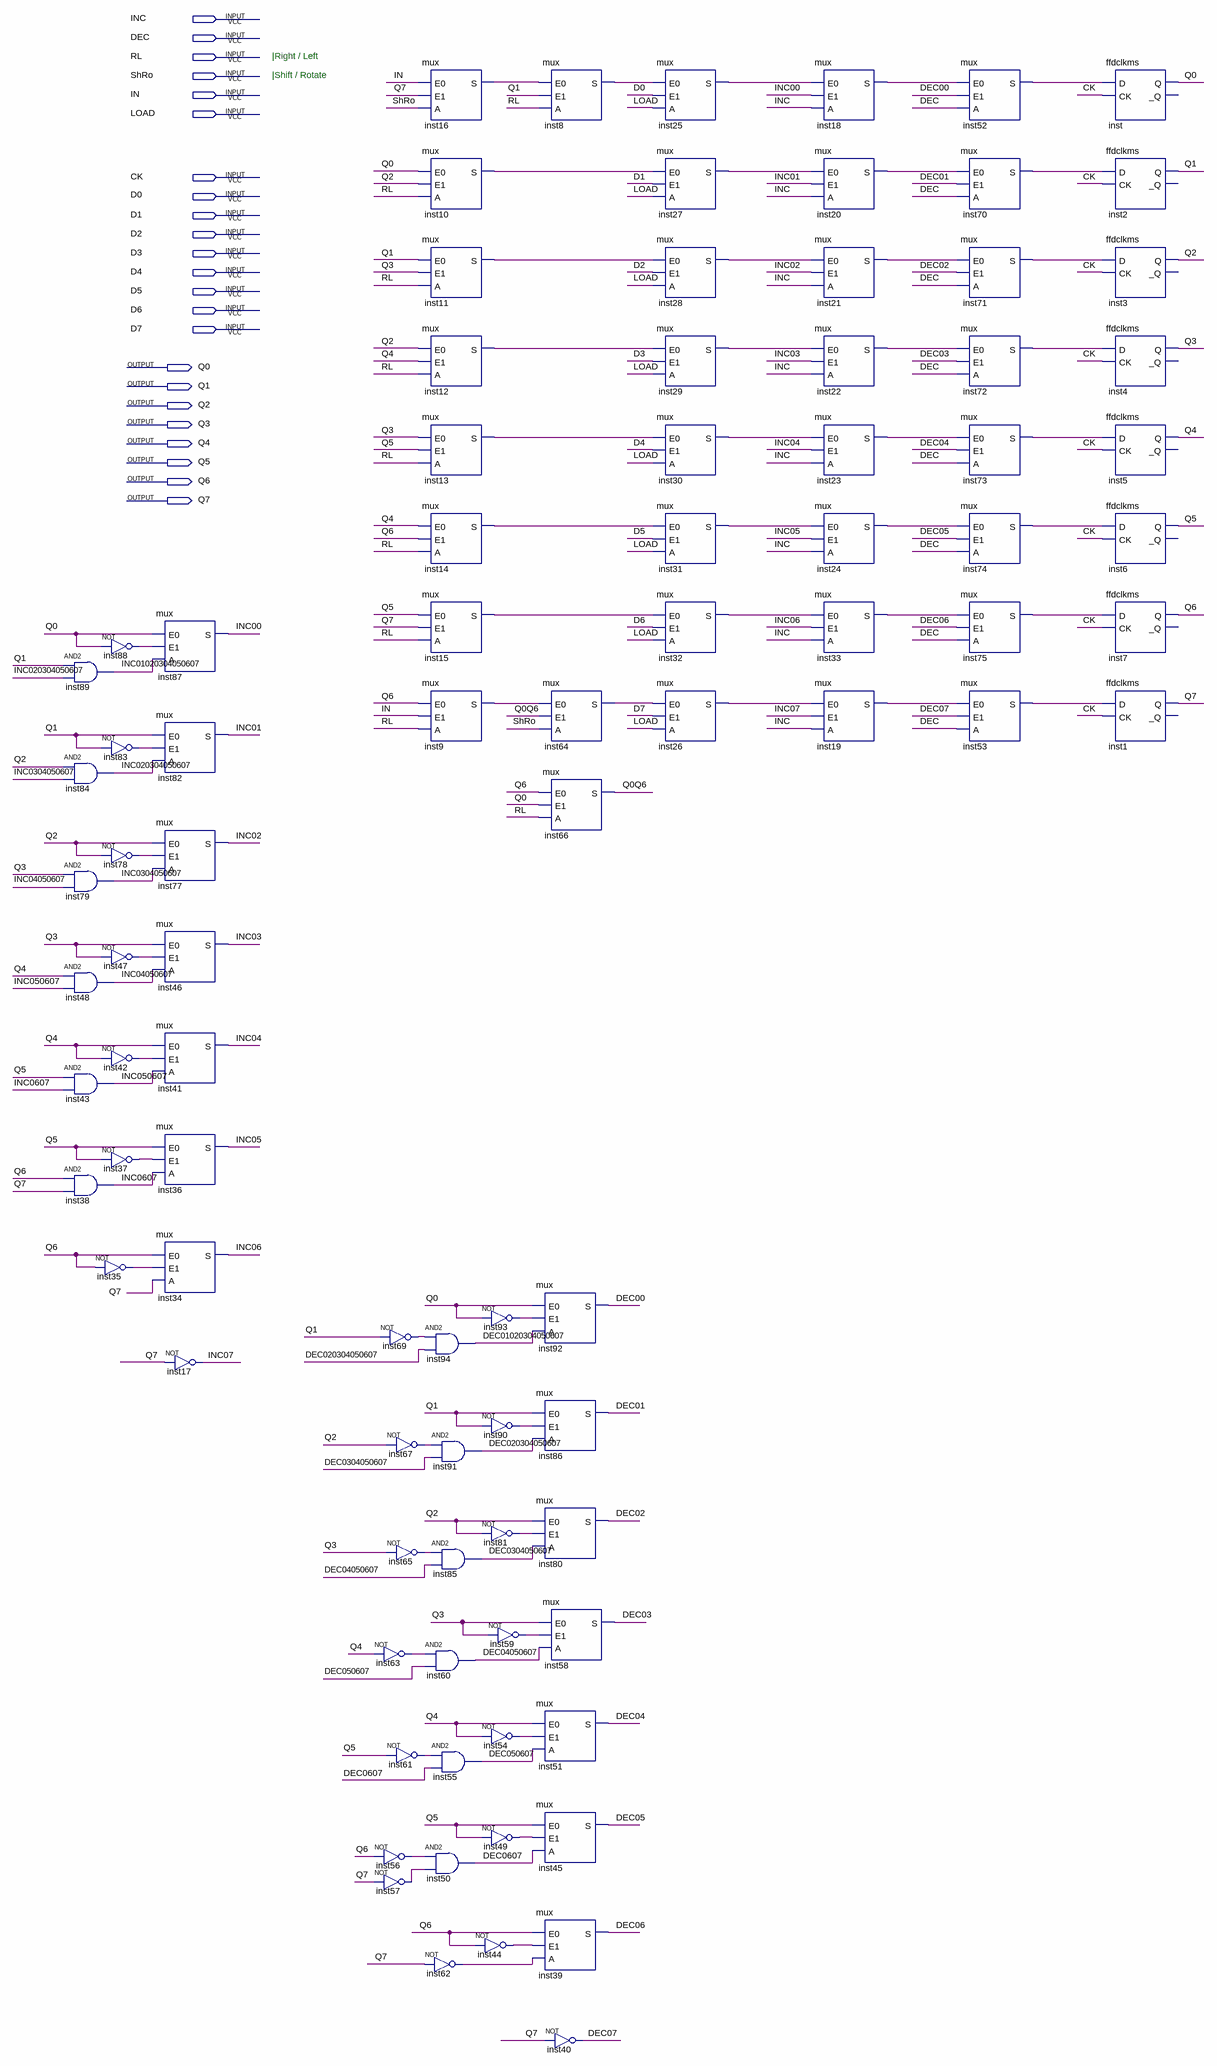
[diagram p0: schematic sheet]
// Quartus schematic registrador8bit.bdf as structural Verilog: 93 symbols, 23 pins
module registrador8bit (
  input  INC,
  input  DEC,
  input  RL,
  input  ShRo,
  input  IN,
  input  LOAD,
  input  CK,
  input  D0,
  input  D1,
  input  D2,
  input  D3,
  input  D4,
  input  D5,
  input  D6,
  input  D7,
  output Q0,
  output Q1,
  output Q2,
  output Q3,
  output Q4,
  output Q5,
  output Q6,
  output Q7
);

  wire DEC00, DEC01, DEC02, DEC03, DEC04, DEC05, DEC06, DEC07, DEC0607, DEC050607, DEC04050607,
       DEC0304050607, DEC020304050607, DEC01020304050607, INC00, INC01, INC02, INC03, INC04, INC05, INC06,
       INC07, INC0607, INC050607, INC04050607, INC0304050607, INC020304050607, INC01020304050607, inst8_s,
       inst9_s, inst10_s, inst11_s, inst12_s, inst13_s, inst14_s, inst15_s, inst16_s, inst18_s, inst19_s,
       inst20_s, inst21_s, inst22_s, inst23_s, inst24_s, inst25_s, inst26_s, inst27_s, inst28_s, inst29_s,
       inst30_s, inst31_s, inst32_s, inst33_s, inst35_out, inst37_out, inst42_out, inst44_out, inst47_out,
       inst49_out, inst52_s, inst53_s, inst54_out, inst56_out, inst57_out, inst59_out, inst61_out,
       inst62_out, inst63_out, inst64_s, inst65_out, inst67_out, inst69_out, inst70_s, inst71_s, inst72_s,
       inst73_s, inst74_s, inst75_s, inst78_out, inst81_out, inst83_out, inst88_out, inst90_out, inst93_out,
       Q0Q6;

  and inst89 (INC01020304050607, Q1, INC020304050607);
  and inst84 (INC020304050607, Q2, INC0304050607);
  and inst79 (INC0304050607, Q3, INC04050607);
  and inst48 (INC04050607, Q4, INC050607);
  and inst43 (INC050607, Q5, INC0607);
  and inst38 (INC0607, Q6, Q7);
  not inst88 (inst88_out, Q0);
  not inst83 (inst83_out, Q1);
  not inst78 (inst78_out, Q2);
  not inst47 (inst47_out, Q3);
  not inst42 (inst42_out, Q4);
  not inst37 (inst37_out, Q5);
  not inst35 (inst35_out, Q6);
  mux inst87 (.E0(Q0), .E1(inst88_out), .A(INC01020304050607), .S(INC00));
  mux inst82 (.E0(Q1), .E1(inst83_out), .A(INC020304050607), .S(INC01));
  mux inst77 (.E0(Q2), .E1(inst78_out), .A(INC0304050607), .S(INC02));
  mux inst46 (.E0(Q3), .E1(inst47_out), .A(INC04050607), .S(INC03));
  mux inst41 (.E0(Q4), .E1(inst42_out), .A(INC050607), .S(INC04));
  mux inst36 (.E0(Q5), .E1(inst37_out), .A(INC0607), .S(INC05));
  mux inst34 (.E0(Q6), .E1(inst35_out), .A(Q7), .S(INC06));
  not inst17 (INC07, Q7);
  not inst69 (inst69_out, Q1);
  not inst67 (inst67_out, Q2);
  not inst65 (inst65_out, Q3);
  not inst63 (inst63_out, Q4);
  not inst61 (inst61_out, Q5);
  not inst56 (inst56_out, Q6);
  not inst57 (inst57_out, Q7);
  mux inst16 (.E0(IN), .E1(Q7), .A(ShRo), .S(inst16_s));
  mux inst10 (.E0(Q0), .E1(Q2), .A(RL), .S(inst10_s));
  mux inst11 (.E0(Q1), .E1(Q3), .A(RL), .S(inst11_s));
  mux inst12 (.E0(Q2), .E1(Q4), .A(RL), .S(inst12_s));
  mux inst13 (.E0(Q3), .E1(Q5), .A(RL), .S(inst13_s));
  mux inst14 (.E0(Q4), .E1(Q6), .A(RL), .S(inst14_s));
  mux inst15 (.E0(Q5), .E1(Q7), .A(RL), .S(inst15_s));
  mux inst9 (.E0(Q6), .E1(IN), .A(RL), .S(inst9_s));
  and inst94 (DEC01020304050607, inst69_out, DEC020304050607);
  and inst91 (DEC020304050607, inst67_out, DEC0304050607);
  and inst85 (DEC0304050607, inst65_out, DEC04050607);
  and inst60 (DEC04050607, inst63_out, DEC050607);
  and inst55 (DEC050607, inst61_out, DEC0607);
  and inst50 (DEC0607, inst56_out, inst57_out);
  not inst62 (inst62_out, Q7);
  not inst93 (inst93_out, Q0);
  not inst90 (inst90_out, Q1);
  not inst81 (inst81_out, Q2);
  not inst59 (inst59_out, Q3);
  not inst54 (inst54_out, Q4);
  not inst49 (inst49_out, Q5);
  not inst44 (inst44_out, Q6);
  mux inst8 (.E0(inst16_s), .E1(Q1), .A(RL), .S(inst8_s));
  mux inst64 (.E0(inst9_s), .E1(Q0Q6), .A(ShRo), .S(inst64_s));
  mux inst66 (.E0(Q6), .E1(Q0), .A(RL), .S(Q0Q6));
  mux inst92 (.E0(Q0), .E1(inst93_out), .A(DEC01020304050607), .S(DEC00));
  mux inst86 (.E0(Q1), .E1(inst90_out), .A(DEC020304050607), .S(DEC01));
  mux inst80 (.E0(Q2), .E1(inst81_out), .A(DEC0304050607), .S(DEC02));
  mux inst58 (.E0(Q3), .E1(inst59_out), .A(DEC04050607), .S(DEC03));
  mux inst51 (.E0(Q4), .E1(inst54_out), .A(DEC050607), .S(DEC04));
  mux inst45 (.E0(Q5), .E1(inst49_out), .A(DEC0607), .S(DEC05));
  mux inst39 (.E0(Q6), .E1(inst44_out), .A(inst62_out), .S(DEC06));
  not inst40 (DEC07, Q7);
  mux inst25 (.E0(inst8_s), .E1(D0), .A(LOAD), .S(inst25_s));
  mux inst27 (.E0(inst10_s), .E1(D1), .A(LOAD), .S(inst27_s));
  mux inst28 (.E0(inst11_s), .E1(D2), .A(LOAD), .S(inst28_s));
  mux inst29 (.E0(inst12_s), .E1(D3), .A(LOAD), .S(inst29_s));
  mux inst30 (.E0(inst13_s), .E1(D4), .A(LOAD), .S(inst30_s));
  mux inst31 (.E0(inst14_s), .E1(D5), .A(LOAD), .S(inst31_s));
  mux inst32 (.E0(inst15_s), .E1(D6), .A(LOAD), .S(inst32_s));
  mux inst26 (.E0(inst64_s), .E1(D7), .A(LOAD), .S(inst26_s));
  mux inst18 (.E0(inst25_s), .E1(INC00), .A(INC), .S(inst18_s));
  mux inst20 (.E0(inst27_s), .E1(INC01), .A(INC), .S(inst20_s));
  mux inst21 (.E0(inst28_s), .E1(INC02), .A(INC), .S(inst21_s));
  mux inst22 (.E0(inst29_s), .E1(INC03), .A(INC), .S(inst22_s));
  mux inst23 (.E0(inst30_s), .E1(INC04), .A(INC), .S(inst23_s));
  mux inst24 (.E0(inst31_s), .E1(INC05), .A(INC), .S(inst24_s));
  mux inst33 (.E0(inst32_s), .E1(INC06), .A(INC), .S(inst33_s));
  mux inst19 (.E0(inst26_s), .E1(INC07), .A(INC), .S(inst19_s));
  mux inst52 (.E0(inst18_s), .E1(DEC00), .A(DEC), .S(inst52_s));
  mux inst70 (.E0(inst20_s), .E1(DEC01), .A(DEC), .S(inst70_s));
  mux inst71 (.E0(inst21_s), .E1(DEC02), .A(DEC), .S(inst71_s));
  mux inst72 (.E0(inst22_s), .E1(DEC03), .A(DEC), .S(inst72_s));
  mux inst73 (.E0(inst23_s), .E1(DEC04), .A(DEC), .S(inst73_s));
  mux inst74 (.E0(inst24_s), .E1(DEC05), .A(DEC), .S(inst74_s));
  mux inst75 (.E0(inst33_s), .E1(DEC06), .A(DEC), .S(inst75_s));
  mux inst53 (.E0(inst19_s), .E1(DEC07), .A(DEC), .S(inst53_s));
  ffdclkms inst (.D(inst52_s), .CK(CK), .Q(Q0));  // open: _Q
  ffdclkms inst2 (.D(inst70_s), .CK(CK), .Q(Q1));  // open: _Q
  ffdclkms inst3 (.D(inst71_s), .CK(CK), .Q(Q2));  // open: _Q
  ffdclkms inst4 (.D(inst72_s), .CK(CK), .Q(Q3));  // open: _Q
  ffdclkms inst5 (.D(inst73_s), .CK(CK), .Q(Q4));  // open: _Q
  ffdclkms inst6 (.D(inst74_s), .CK(CK), .Q(Q5));  // open: _Q
  ffdclkms inst7 (.D(inst75_s), .CK(CK), .Q(Q6));  // open: _Q
  ffdclkms inst1 (.D(inst53_s), .CK(CK), .Q(Q7));  // open: _Q

  // Notes on the sheet:
  //   |Right / Left
  //   |Shift / Rotate
endmodule
